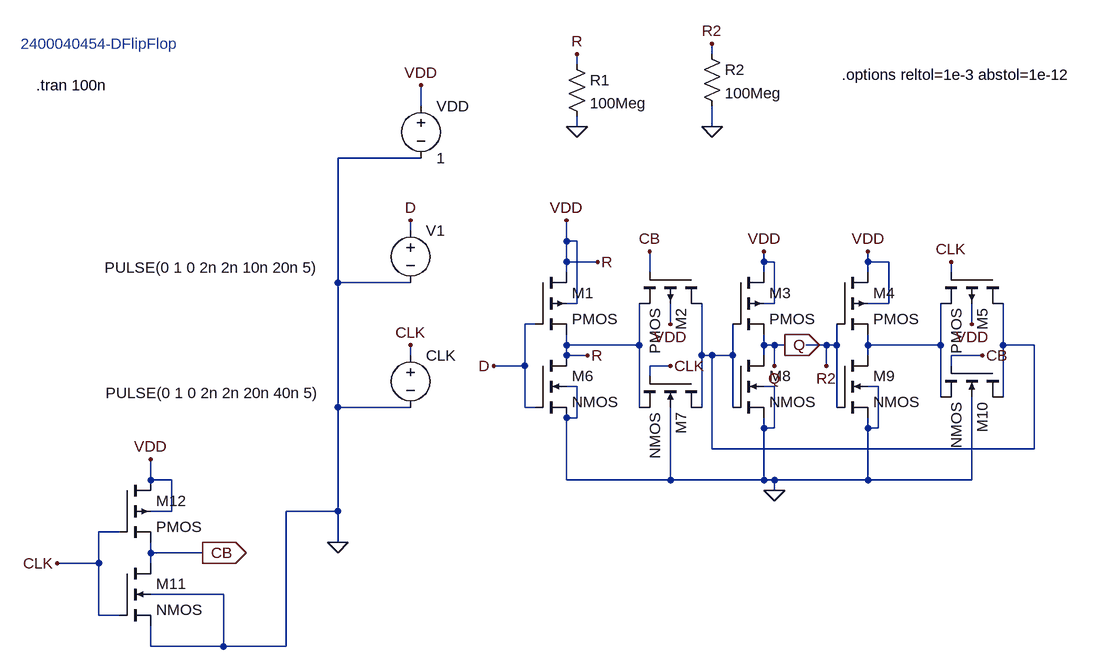
[diagram p0: schematic DFlipflop.asc]
DFlipflop.asc, the LTspice schematic file:
Version 4.1
SHEET 1 880 680
WIRE 144 -288 144 -304
WIRE -64 -272 -64 -288
WIRE -304 -208 -304 -240
WIRE -64 -176 -64 -192
WIRE 144 -176 144 -208
WIRE -304 -128 -432 -128
WIRE -320 -16 -320 -32
WIRE -80 0 -80 -32
WIRE -64 0 -80 0
WIRE -80 32 -80 0
WIRE -32 32 -80 32
WIRE 224 32 224 16
WIRE 240 32 224 32
WIRE 384 32 384 16
WIRE 416 32 384 32
WIRE -80 48 -80 32
WIRE 48 48 48 16
WIRE 224 48 224 32
WIRE 384 48 384 32
WIRE 512 48 512 32
WIRE -432 64 -432 -128
WIRE -320 64 -432 64
WIRE -64 96 -64 0
WIRE -64 96 -80 96
WIRE 240 96 240 32
WIRE 240 96 224 96
WIRE 416 96 416 32
WIRE 416 96 384 96
WIRE -128 128 -144 128
WIRE 80 128 80 96
WIRE 544 128 544 96
WIRE -80 160 -80 144
WIRE 32 160 32 96
WIRE 32 160 -80 160
WIRE 224 160 224 144
WIRE 240 160 224 160
WIRE 256 160 240 160
WIRE 320 160 288 160
WIRE 336 160 336 128
WIRE 336 160 320 160
WIRE 384 160 384 144
WIRE 496 160 496 96
WIRE 496 160 384 160
WIRE 592 160 592 96
WIRE 640 160 592 160
WIRE -320 176 -320 160
WIRE -80 176 -80 160
WIRE -48 176 -80 176
WIRE 128 176 128 96
WIRE 144 176 128 176
WIRE 176 176 176 128
WIRE 176 176 144 176
WIRE 224 176 224 160
WIRE 384 176 384 160
WIRE 560 176 512 176
WIRE -144 192 -144 128
WIRE -144 192 -192 192
WIRE 80 192 48 192
WIRE 240 192 240 160
WIRE 320 192 320 160
WIRE 512 192 512 176
WIRE 48 208 48 192
WIRE -64 224 -80 224
WIRE 240 224 224 224
WIRE 400 224 384 224
WIRE 496 240 496 160
WIRE 592 240 592 160
WIRE -432 256 -432 64
WIRE -320 256 -432 256
WIRE -144 256 -144 192
WIRE -128 256 -144 256
WIRE 32 256 32 160
WIRE 128 256 128 176
WIRE 176 256 176 176
WIRE 336 256 336 160
WIRE -64 272 -64 224
WIRE -64 272 -80 272
WIRE 224 288 224 272
WIRE 240 288 240 224
WIRE 240 288 224 288
WIRE 384 288 384 272
WIRE 400 288 400 224
WIRE 400 288 384 288
WIRE 144 320 144 176
WIRE 640 320 640 160
WIRE 640 320 144 320
WIRE -720 368 -720 336
WIRE -688 368 -720 368
WIRE -80 368 -80 272
WIRE 80 368 80 256
WIRE 80 368 -80 368
WIRE 224 368 224 288
WIRE 224 368 80 368
WIRE 240 368 224 368
WIRE 384 368 384 288
WIRE 384 368 240 368
WIRE 544 368 544 240
WIRE 544 368 384 368
WIRE 240 384 240 368
WIRE -688 416 -688 368
WIRE -688 416 -720 416
WIRE -432 416 -432 256
WIRE -432 416 -512 416
WIRE -768 448 -800 448
WIRE -432 464 -432 416
WIRE -720 480 -720 464
WIRE -640 480 -720 480
WIRE -800 496 -800 448
WIRE -800 496 -864 496
WIRE -720 496 -720 480
WIRE -608 544 -720 544
WIRE -800 576 -800 496
WIRE -768 576 -800 576
WIRE -720 624 -720 592
WIRE -608 624 -608 544
WIRE -608 624 -720 624
WIRE -512 624 -512 416
WIRE -512 624 -608 624
FLAG 240 384 0
FLAG -320 160 CLK
FLAG -320 -32 D
FLAG -192 192 D
FLAG -304 -240 VDD
FLAG 224 16 VDD
FLAG 384 16 VDD
FLAG 48 16 CB
FLAG 560 176 CB
FLAG 80 128 VDD
FLAG 80 192 CLK
FLAG 512 32 CLK
FLAG 544 128 VDD
FLAG -64 -288 R
FLAG -64 -176 0
FLAG -32 32 R
FLAG -80 -32 VDD
FLAG -48 176 R
FLAG 144 -304 R2
FLAG 144 -176 0
FLAG 256 160 Q
IOPIN 256 160 Out
FLAG 240 192 Q
FLAG 320 192 R2
FLAG -432 464 0
FLAG -720 336 VDD
FLAG -640 480 CB
IOPIN -640 480 Out
FLAG -864 496 CLK
SYMBOL pmos4 -128 48 R0
SYMATTR InstName M1
SYMBOL pmos4 128 48 R90
SYMATTR InstName M2
SYMBOL pmos4 176 48 R0
SYMATTR InstName M3
SYMBOL pmos4 336 48 R0
SYMATTR InstName M4
SYMBOL pmos4 592 48 R90
SYMATTR InstName M5
SYMBOL nmos4 -128 176 R0
SYMATTR InstName M6
SYMBOL nmos4 128 208 R90
SYMATTR InstName M7
SYMBOL nmos4 176 176 R0
SYMATTR InstName M8
SYMBOL nmos4 336 176 R0
SYMATTR InstName M9
SYMBOL nmos4 592 192 R90
SYMATTR InstName M10
SYMBOL voltage -320 -32 R0
WINDOW 3 -471 73 Left 2
WINDOW 123 0 0 Left 0
WINDOW 39 0 0 Left 0
SYMATTR Value PULSE(0 1 0 2n 2n 10n 20n 5)
SYMATTR InstName V1
SYMBOL voltage -320 160 R0
WINDOW 3 -469 74 Left 2
WINDOW 123 0 0 Left 0
WINDOW 39 0 0 Left 0
SYMATTR Value PULSE(0 1 0 2n 2n 20n 40n 5)
SYMATTR InstName CLK
SYMBOL voltage -304 -224 R0
WINDOW 123 0 0 Left 0
WINDOW 39 0 0 Left 0
SYMATTR InstName VDD
SYMATTR Value 1
SYMBOL res -80 -288 R0
SYMATTR InstName R1
SYMATTR Value 100Meg
SYMBOL res 128 -304 R0
SYMATTR InstName R2
SYMATTR Value 100Meg
SYMBOL nmos4 -768 496 R0
SYMATTR InstName M11
SYMBOL pmos4 -768 368 R0
SYMATTR InstName M12
TEXT -896 -240 Left 2 !.tran 100n
TEXT 344 -256 Left 2 !.options reltol=1e-3 abstol=1e-12
TEXT -920 -304 Left 2 ;2400040454-DFlipFlop

The netlist it stands for:
* DFlipflop.asc
M1 R D R R PMOS
M2 N002 CB R R PMOS
M3 R N002 Q R PMOS
M4 R R2 N001 R PMOS
M5 N002 CLK N001 R PMOS
M6 R D 0 0 NMOS
M7 N002 CLK R 0 NMOS
M8 Q N002 0 0 NMOS
M9 N001 R2 0 0 NMOS
M10 N002 CB N001 0 NMOS
V1 D 0 PULSE(0 1 0 2n 2n 10n 20n 5)
V§CLK CLK 0 PULSE(0 1 0 2n 2n 20n 40n 5)
VDD R 0 1
R1 R 0 100Meg
R2 R2 0 100Meg
M11 CB CLK 0 0 NMOS
M12 R CLK CB R PMOS
.model NMOS NMOS
.model PMOS PMOS
.lib standard.mos
.tran 100n
.options reltol=1e-3 abstol=1e-12
* 2400040454-DFlipFlop
.backanno
.end